# Altium project Digital Clock.PrjPCB
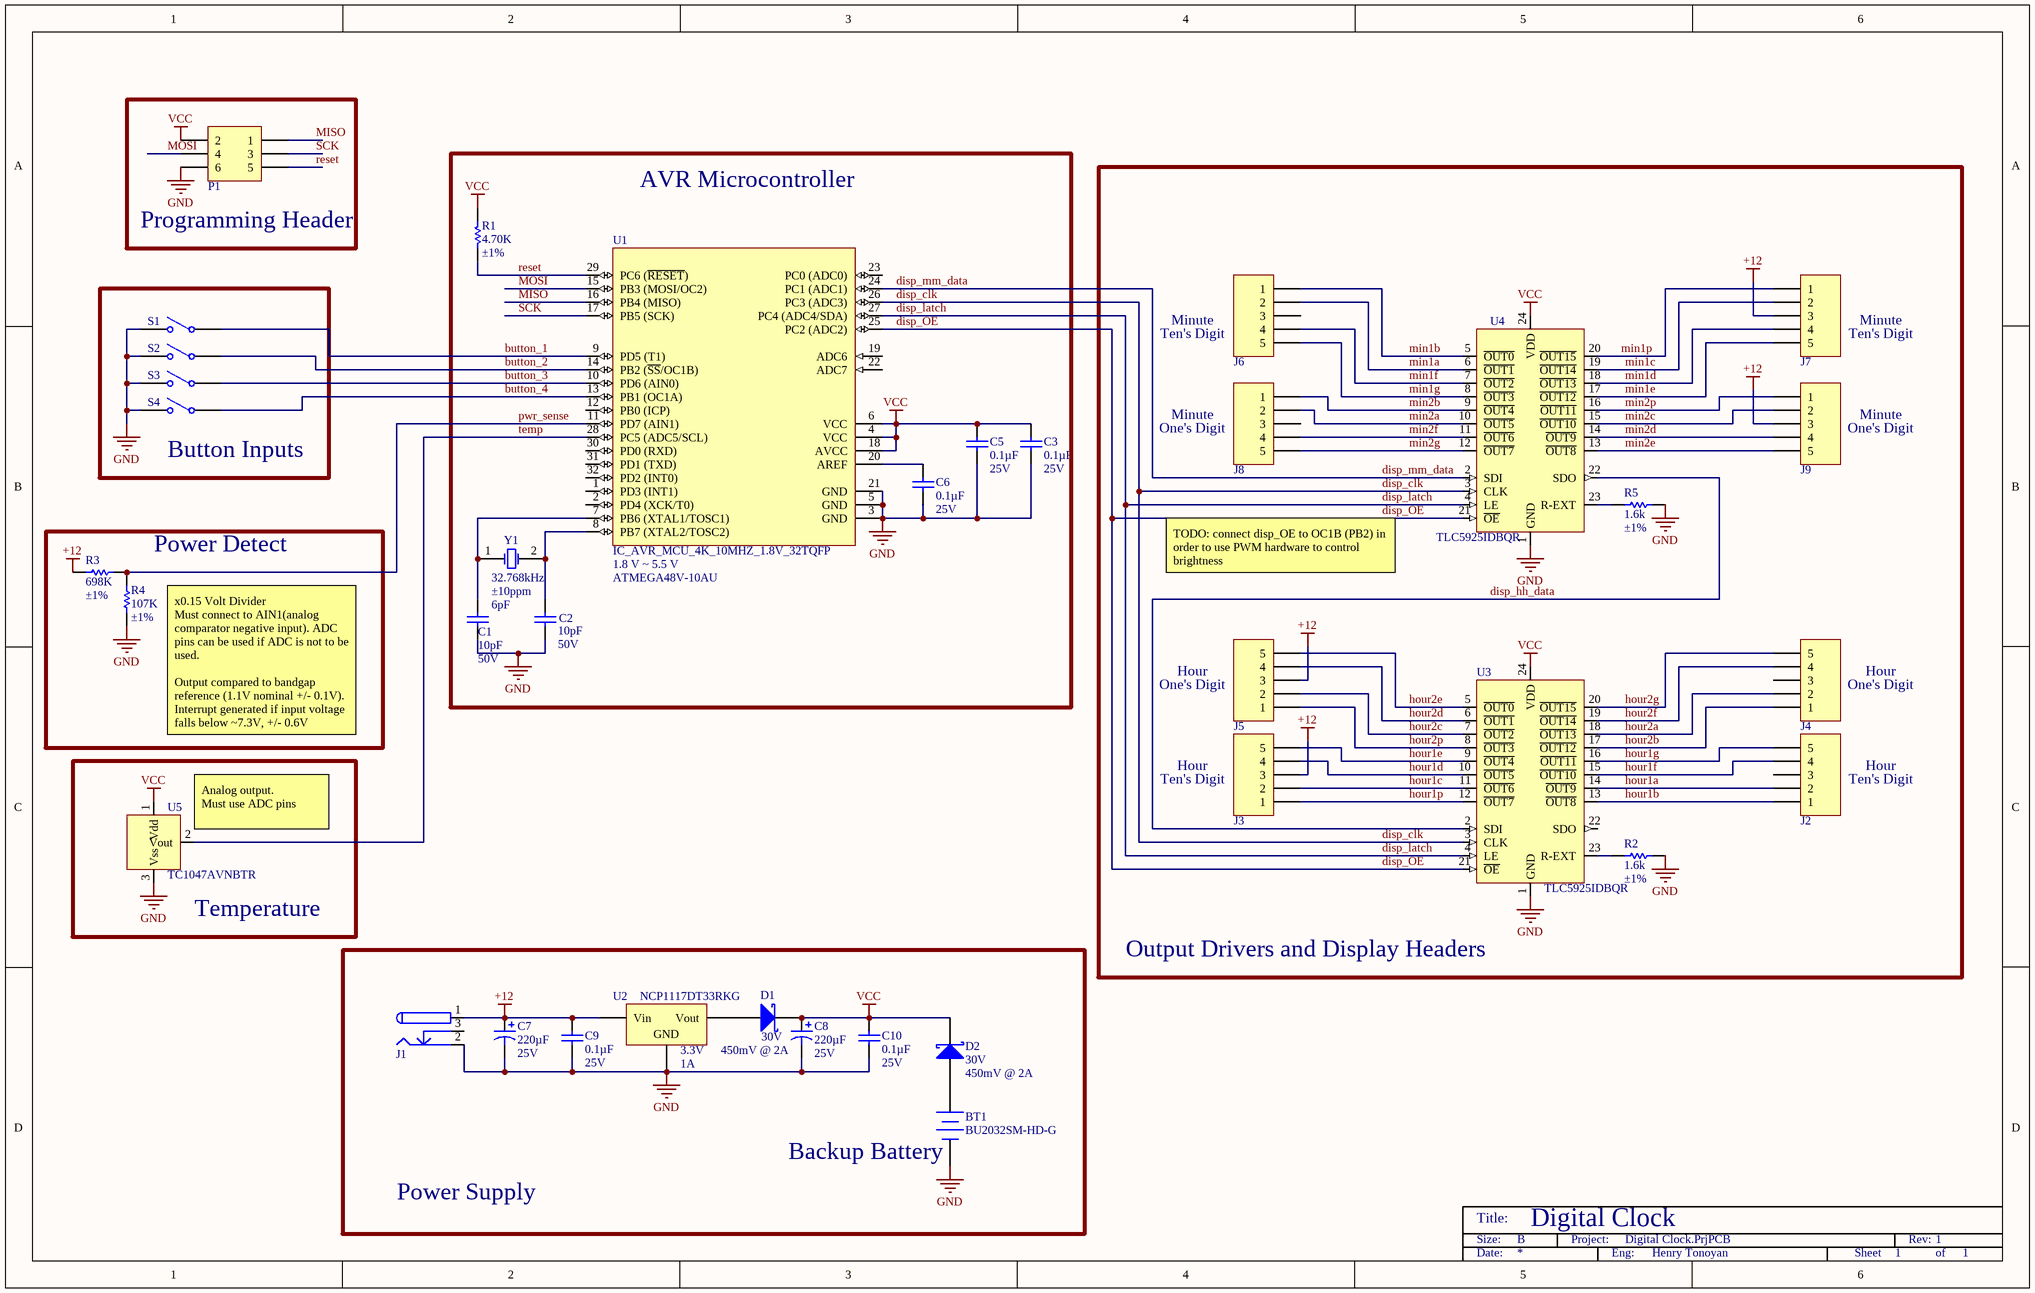
[diagram p0: main.SchDoc]
1 sheet, 37 parts. Net scope: global (net labels, ports and power ports of the same name join across sheets).
Board file: PCB1.PcbDoc

## Sheet main.SchDoc: Digital Clock
size B; Engineer: Henry Tonoyan; Revision: 1; SheetNumber: 1; SheetTotal: 1

### Parts
BT1  HOLDER COIN CELL 2032 SMD  [BU2032SM-HD-G]  (value not drawn)
C1  Capacitance: 10pF  Voltage - Rated: 50V  [0603]  (hidden comment: CAP CER 10PF 50V 5% C0G 0603)
C2  Capacitance: 10pF  Voltage - Rated: 50V  [0603]  (hidden comment: CAP CER 10PF 50V 5% C0G 0603)
C3  Capacitance: 0.1µF  Voltage - Rated: 25V  [0603]  (hidden comment: CAP CER .10UF 25V X7R 10% 0603)
C5  Capacitance: 0.1µF  Voltage - Rated: 25V  [0603]  (hidden comment: CAP CER .10UF 25V X7R 10% 0603)
C6  Capacitance: 0.1µF  Voltage - Rated: 25V  [0603]  (hidden comment: CAP CER .10UF 25V X7R 10% 0603)
C7  Capacitance: 220µF  Voltage Rating: 25V  [CAP AVE227M25F24T-F]  (hidden comment: CAP ALUM 220UF 25V 20% SMD)
C8  Capacitance: 220µF  Voltage Rating: 25V  [CAP AVE227M25F24T-F]  (hidden comment: CAP ALUM 220UF 25V 20% SMD)
C9  Capacitance: 0.1µF  Voltage - Rated: 25V  [0603]  (hidden comment: CAP CER .10UF 25V X7R 10% 0603)
C10  Capacitance: 0.1µF  Voltage - Rated: 25V  [0603]  (hidden comment: CAP CER .10UF 25V X7R 10% 0603)
D1  Voltage - DC Reverse (Vr) (Max): 30V  Voltage - Forward (Vf) (Max) @ If: 450mV @ 2A  [DSO-C2/X2.3]  (hidden comment: DIODE_SCHOTTKY_30V_2A_SMB)
D2  Voltage - DC Reverse (Vr) (Max): 30V  Voltage - Forward (Vf) (Max) @ If: 450mV @ 2A  [DSO-C2/X2.3]  (hidden comment: DIODE_SCHOTTKY_30V_2A_SMB)
J1  CONN_PWR2.0_SMT  [CONN_PWR2.0_SMT]  (value not drawn)
J2  CONN_HEADER_VERT_5POS_.100_TIN  [CONN_HDR1X5]  (value not drawn)
J3  CONN_HEADER_VERT_5POS_.100_TIN  [CONN_HDR1X5]  (value not drawn)
J4  CONN_HEADER_VERT_5POS_.100_TIN  [CONN_HDR1X5]  (value not drawn)
J5  CONN_HEADER_VERT_5POS_.100_TIN  [CONN_HDR1X5]  (value not drawn)
J6  CONN_HEADER_VERT_5POS_.100_TIN  [CONN_HDR1X5]  (value not drawn)
J7  CONN_HEADER_VERT_5POS_.100_TIN  [CONN_HDR1X5]  (value not drawn)
J8  CONN_HEADER_VERT_5POS_.100_TIN  [CONN_HDR1X5]  (value not drawn)
J9  CONN_HEADER_VERT_5POS_.100_TIN  [CONN_HDR1X5]  (value not drawn)
P1  Header, 3-Pin, Dual row  [CONN_HDR_SMT_6_2R]  (value not drawn)
R1  Resistance (Ohms): 4.70K  Tolerance: ±1%  [0603]  (hidden comment: RES_4.70K_OHM_1/10W_1%_0603_SMD)
R2  Resistance (Ohms): 1.6k  Tolerance: ±1%  [0603]  (hidden comment: RES_1.60K_OHM_1/10W_1%_0603_SMD)
R3  Resistance (Ohms): 698K  Tolerance: ±1%  [0603]  (hidden comment: RES_698K_OHM_1/10W_1%_0603_SMD)
R4  Resistance (Ohms): 107K  Tolerance: ±1%  [0603]  (hidden comment: RES_107K_OHM_1/10W_1%_0603_SMD)
R5  Resistance (Ohms): 1.6k  Tolerance: ±1%  [0603]  (hidden comment: RES_1.60K_OHM_1/10W_1%_0603_SMD)
S1  SW_1571634-2  [1571634-2]  (value not drawn)
S2  SW_1571634-2  [1571634-2]  (value not drawn)
S3  SW_1571634-2  [1571634-2]  (value not drawn)
S4  SW_1571634-2  [1571634-2]  (value not drawn)
U1  IC_AVR_MCU_4K_10MHZ_1.8V_32TQFP  Voltage - Supply (Vcc/Vdd): 1.8 V ~ 5.5 V  Manufacturer Part Number: ATMEGA48V-10AU  [32A_N]
U2  Manufacturer Part Number: NCP1117DT33RKG  Voltage - Output: 3.3V  Current - Output: 1A  [DPAK]  (hidden comment: IC_REG_LDO_3.3V_DPAK)
U3  Manufacturer Part Number: TLC5925IDBQR  [SOP24]  (hidden comment: IC_LED_DRIVER_LINEAR_24-QSOP)
U4  Manufacturer Part Number: TLC5925IDBQR  [SOP24]  (hidden comment: IC_LED_DRIVER_LINEAR_24-QSOP)
U5  Manufacturer Part Number: TC1047AVNBTR  [SOT23-3N]  (hidden comment: Temperature Sensor)
Y1  Frequency: 32.768kHz  Frequency Tolerance: ±10ppm  Load Capacitance: 6pF  [ABS25]  (hidden comment: CRYSTAL_32.768_KHZ_6.0 PF_SMD)

### Blocks framed on the sheet
Programming Header: P1
AVR Microcontroller: C1-C3 C5 C6 R1 U1 Y1
Output Drivers and Display Headers: J2-J9 R2 R5 U3 U4
Button Inputs: S1-S4
Power Detect: R3 R4
Temperature: U5

### Nets
+12: C7.1 C9.2 J1.1 J3.3 J5.3 J7.3 J9.3 R3.1 U2.1(Vin)
GND: BT1.2(-) C1.1 C2.1 C3.2 C5.2 C6.2 C7.2 C8.2 C9.1 C10.1 J1.2 P1.6 R2.2 R4.1 R5.2 S1.2(NO) S2.2(NO) S3.2(NO) S4.2(NO) U1.3(GND) U1.5(GND) U1.21(GND) U2.2(GND) U3.1(GND) U4.1(GND) U5.3(Vss)
VCC: C3.1 C5.1 C8.1 C10.2 D1.2(K) D2.2(K) P1.2 R1.2 U1.4(VCC) U1.6(VCC) U1.18(AVCC) U3.24(VDD) U4.24(VDD) U5.1(Vdd)
button_1: S1.1(COMMON) U1.9(PD5_(T1))
button_2: S2.1(COMMON) U1.14(PB2_(~{SS}/OC1B))
button_3: S3.1(COMMON) U1.10(PD6_(AIN0))
button_4: S4.1(COMMON) U1.13(PB1_(OC1A))
disp_clk: U1.26(PC3_(ADC3)) U3.3(CLK) U4.3(CLK)
disp_hh_data: U3.2(SDI) U4.22(SDO)
disp_latch: U1.27(PC4_(ADC4/SDA)) U3.4(LE) U4.4(LE)
disp_mm_data: U1.24(PC1_(ADC1)) U4.2(SDI)
disp_~{OE}: U1.25(PC2_(ADC2)) U3.21(~{OE}) U4.21(~{OE})
hour1a: J2.2 U3.14(~{OUT9})
hour1b: J2.1 U3.13(~{OUT8})
hour1c: J3.2 U3.11(~{OUT6})
hour1d: J3.4 U3.10(~{OUT5})
hour1e: J3.5 U3.9(~{OUT4})
hour1f: J2.4 U3.15(~{OUT10})
hour1g: J2.5 U3.16(~{OUT11})
hour1p: J3.1 U3.12(~{OUT7})
hour2a: J4.2 U3.18(~{OUT13})
hour2b: J4.1 U3.17(~{OUT12})
hour2c: J5.2 U3.7(~{OUT2})
hour2d: J5.4 U3.6(~{OUT1})
hour2e: J5.5 U3.5(~{OUT0})
hour2f: J4.4 U3.19(~{OUT14})
hour2g: J4.5 U3.20(~{OUT15})
hour2p: J5.1 U3.8(~{OUT3})
min1a: J6.2 U4.6(~{OUT1})
min1b: J6.1 U4.5(~{OUT0})
min1c: J7.2 U4.19(~{OUT14})
min1d: J7.4 U4.18(~{OUT13})
min1e: J7.5 U4.17(~{OUT12})
min1f: J6.4 U4.7(~{OUT2})
min1g: J6.5 U4.8(~{OUT3})
min1p: J7.1 U4.20(~{OUT15})
min2a: J8.2 U4.10(~{OUT5})
min2b: J8.1 U4.9(~{OUT4})
min2c: J9.2 U4.15(~{OUT10})
min2d: J9.4 U4.14(~{OUT9})
min2e: J9.5 U4.13(~{OUT8})
min2f: J8.4 U4.11(~{OUT6})
min2g: J8.5 U4.12(~{OUT7})
min2p: J9.1 U4.16(~{OUT11})
MISO: P1.1 U1.16(PB4_(MISO))
MOSI: P1.4 U1.15(PB3_(MOSI/OC2))
pwr_sense: R3.2 R4.2 U1.11(PD7_(AIN1))
reset: P1.5 R1.1 U1.29(PC6_(~{RESET}))
SCK: P1.3 U1.17(PB5_(SCK))
temp: U1.28(PC5_(ADC5/SCL)) U5.2(Vout)
NetBT1_1: BT1.1(+) D2.1(A)
NetC1_2: C1.2 U1.7(PB6_(XTAL1/TOSC1)) Y1.1(OSC1)
NetC2_2: C2.2 U1.8(PB7_(XTAL2/TOSC2)) Y1.2(OSC2)
NetC6_1: C6.1 U1.20(AREF)
NetD1_1: D1.1(A) U2.3(Vout)
NetR2_1: R2.1 U3.23(R-EXT)
NetR5_1: R5.1 U4.23(R-EXT)

Not connected (* = marked no-connect by the designer): J1 3; J2 3; J4 3; J6 3; J8 3; U1 1(PD3_(INT1)) 2(PD4_(XCK/T0)) 12(PB0_(ICP)) 19(ADC6) 22(ADC7) 23(PC0_(ADC0)) 30(PD0_(RXD)) 31(PD1_(TXD)) 32(PD2_(INT0)); U3 22(SDO)

### Notes on the sheet
- Minute
- (near J6) Ten's Digit
- (near J7) Ten's Digit
- (near J8) One's Digit
- (near J9) One's Digit
- TODO: connect disp_OE to OC1B (PB2) in order to use PWM hardware to control brightness
- Hour
- (near J5) One's Digit
- (near J4) One's Digit
- x0.15 Volt Divider
  Must connect to AIN1(analog comparator negative input). ADC pins can be used if ADC is not to be used.
  Output compared to bandgap reference (1.1V nominal +/- 0.1V). Interrupt generated if input voltage falls below ~7.3V, +/- 0.6V
- (near U5) Analog output.
  Must use ADC pins
- (near J3) Ten's Digit
- (near J2) Ten's Digit
- (near BT1) Backup Battery
- Power Supply
- Title:
- Size:
- B
- Project:
- Rev:
- Date:
- Eng:
- Sheet
- of

### Library data of the parts
BT1 = BU2032SM-HD-G: Manufacturer: MPD (Memory Protection Devices); Battery Type, Function: Coin Cell, Holder; Style: Holder (Open); Battery Cell Size: Coin, 20.0mm; Number of Cells: 1; Battery Series: 2032; Supplier 1: Digi-Key; RoHS: RoHS Compliant; Category: Battery Products; Stock 1: 33207; Pricing 1: 1=0.82, 10=0.755 (USD); Mounting Type: PCB, Surface Mount; Termination Style: SMD (SMT) Tab; Height Above Board: 0.208" (5.28mm); Operating Temperature: -40°C ~ 280°C; ComponentLink1URL: http://www.memoryprotectiondevices.com/datasheets/BU2032SM-HD-G-datasheet.pdf; ComponentLink1Description: Datasheet; Supplier Part Number 1: BU2032SM-HD-GDKR-ND; Manufacturer Part Number: BU2032SM-HD-G
C1 C2 = CAP_CER_10PF_50V_5%_C0G_0603: Manufacturer: Murata Electronics North America; Manufacturer Part Number: GRM1885C1H100JA01D; Temperature Coefficient: C0G, NP0; Supplier 1: Digi-Key; RoHS: RoHS Compliant; Category: Capacitors; Stock 1: 81574; Pricing 1: 1=0.1, 10=0.041, 50=0.0222, 100=0.0187, 250=0.01532, 500=0.0131, 1000=0.0102 (USD); Tolerance: ±5%; Mounting Type: Surface Mount, MLCC; Operating Temperature: -55°C ~ 125°C; Applications: General Purpose; Ratings: -; Package / Case: 0603 (1608 Metric); Size / Dimension: 0.063" L x 0.031" W (1.60mm x 0.80mm); Height - Seated (Max): -; Thickness (Max): 0.035" (0.90mm); Lead Spacing: -; Features: -; Packaging: Cut Tape (CT); Lead Style: -; ComponentLink1URL: http://search.murata.co.jp/Ceramy/image/img/PDF/ENG/GRM1885C1H100JA01.pdf; ComponentLink1Description: Datasheet; Supplier Part Number 1: 490-1403-1-ND
C3 C5 C6 C9 C10 = CAP_CER_.10UF_25V_X7R_10%_0603_1: Manufacturer: TDK Corporation; Manufacturer Part Number: C1608X7R1E104K; Supplier 1: Digi-Key; RoHS: RoHS Compliant; Category: Capacitors; Stock 1: 1271235; Pricing 1: 1=0.1, 10=0.024, 100=0.011, 250=0.009, 500=0.0077, 1000=0.006 (USD); Tolerance: ±10%; Temperature Coefficient: X7R; Mounting Type: Surface Mount, MLCC; Operating Temperature: -55°C ~ 125°C; Applications: General Purpose; Ratings: -; Package / Case: 0603 (1608 Metric); Size / Dimension: 0.063" L x 0.031" W (1.60mm x 0.80mm); Height - Seated (Max): -; Thickness (Max): 0.037" (0.95mm); Lead Spacing: -; Features: -; Packaging: Cut Tape (CT); Lead Style: -; ComponentLink1URL: http://www.tdk.com/pdf/general_B11.pdf; ComponentLink1Description: Datasheet; Supplier Part Number 1: 445-1316-1-ND
C7 C8 = CAP_ALUM_220UF_25V_20%_SMD: Manufacturer: Cornell Dubilier Electronics (CDE); Manufacturer Part Number: AVE227M25F24T-F; Lifetime @ Temp.: 2000 Hrs @ 85°C; Ripple Current: 252mA; ESR (Equivalent Series Resistance): 1.06 Ohm; Surface Mount Land Size: 0.331" L x 0.331" W (8.40mm x 8.40mm); Supplier 1: Digi-Key; RoHS: RoHS Compliant; Category: Capacitors; Stock 1: 1214; Pricing 1: 1=0.69, 10=0.663, 100=0.3218, 250=0.26732 (USD); Tolerance: ±20%; Operating Temperature: -40°C ~ 85°C; Features: General Purpose; Impedance: -; Mounting Type: Surface Mount; Package / Case: Radial, Can - SMD; Size / Dimension: 0.315" Dia (8.00mm); Height - Seated (Max): 0.394" (10.00mm); Lead Spacing: -; Packaging: Cut Tape (CT); ComponentLink1URL: http://www.cde.com/catalogs/AVE.pdf; ComponentLink1Description: Datasheet; Supplier Part Number 1: 338-1807-1-ND
D1 D2 = DIODE_SCHOTTKY_30V_2A_SMB: DIODE SCHOTTKY 30V 2A SMB; Manufacturer: STMicroelectronics; Manufacturer Part Number: STPS2L30UF; Speed: Fast Recovery =< 500ns, > 200mA (Io); Current - Reverse Leakage @ Vr: 200µA @ 30V; Supplier 1: Digi-Key; RoHS: RoHS Compliant; Category: Discrete Semiconductor Products; Stock 1: 6877; Pricing 1: 1=0.91, 10=0.798, 25=0.7048, 100=0.6144, 250=0.53484, 500=0.45526, 1000=0.36465, 2500=0.32929 (USD); Diode Type: Schottky; Reverse Recovery Time (trr): -; Capacitance @ Vr, F: -; Mounting Type: Surface Mount; Package / Case: DO-214AA, SMB; Supplier Device Package: SMBflat; Packaging: Digi-Reel®; ComponentLink1URL: http://www.st.com/internet/com/TECHNICAL_RESOURCES/TECHNICAL_LITERATURE/DATASHEET/CD00001633.pdf; ComponentLink1Description: Datasheet; Supplier Part Number 1: 497-8030-6-ND; Current - Average Rectified (Io): 2A
J1 = CONN_PWR2.0_SMT: CONN PWR JACK 2.0X6.3MM SMT; Manufacturer: CUI Inc; Manufacturer Part Number: PJ-036A-SMT; Gender: Male; Plug/Mating Plug Diameter: 2.1mm ID, 5.5mm OD; Number of Positions/Contacts: 2 Conductors, 3 Contacts; Internal Switch(s): Single Switch, Normally Closed; Shielding: Unshielded; Voltage - Rated: 16VDC; Current Rating: 2.5A; Supplier 1: Digi-Key; RoHS: RoHS Compliant; Category: Connectors, Interconnects; Stock 1: 20300; Pricing 1: 1=1.67, 10=1.297, 100=0.9895 (USD); Connector Type: Jack; Mounting Type: Surface Mount, Right Angle; Termination: Solder; Features: -; Color: Black; Contact Material: Brass; Contact Material - Plating: Silver; Housing Color: Black; Housing Material: Thermoplastic; Operating Temperature: -25°C ~ 85°C; ComponentLink1URL: http://www.cui.com/Product/Resource/DigiKeyPDF/PJ-036A-SMT.pdf; ComponentLink1Description: Datasheet; Supplier Part Number 1: CP-036APJCT-ND
J2-J9 = CONN_HEADER_VERT_5POS_.100_TIN: CONN HEADER VERT 5POS .100 TIN; Manufacturer: TE Connectivity; Manufacturer Part Number: 640454-5; Connector Type: Header, Unshrouded; Number of Positions: 5; Number of Positions Loaded: All; Pitch: 0.100" (2.54mm); Supplier 1: Digi-Key; RoHS: RoHS Compliant; Category: Connectors, Interconnects; Stock 1: 9451; Pricing 1: 1=0.19, 10=0.179, 50=0.1332, 100=0.1238, 250=0.10948, 500=0.10472, 1000=0.08568, 2500=0.07854, 5000=0.0714 (USD); Contact Type: Male Pin; Number of Rows: 1; Row Spacing: -; Contact Mating Length: 0.295" (7.49mm); Mounting Type: Through Hole; Termination: Solder; Fastening Type: -; Features: Polarizing Key; Contact Finish: Tin; Contact Finish Thickness: -; Color: Natural; Packaging: Bulk; ComponentLink1URL: http://www.te.com/commerce/DocumentDelivery/DDEController?Action=srchrtrv&DocNm=640454&DocType=Customer+Drawing&DocLang=English; ComponentLink1Description: http://www.te.com/commerce/DocumentDelivery/DDEController?Action=srchrtrv&DocNm=640454&DocType=Customer+Drawing&DocLang=English; Supplier Part Number 1: A19432-ND
P1 = CONN_Header_0.100_6pos: Manufacturer: Molex Connector Corporation; Connector Type: Header, Unshrouded, Breakaway; Number of Positions: 6; Number of Positions Loaded: All; Pitch: 0.100" (2.54mm); Supplier 1: Digi-Key; Manufacturer Part Number: 15-91-2060; RoHS: RoHS Compliant; Category: Connectors, Interconnects; Stock 1: 2541; Pricing 1: 1=0.82, 10=0.576, 50=0.4442, 100=0.3866, 250=0.329, 500=0.31256, 1000=0.27965, 2500=0.22208, 5000=0.21879 (USD); Contact Type: Male Pin; Number of Rows: 2; Row Spacing: 0.100" (2.54mm); Contact Mating Length: 0.240" (6.10mm); Mounting Type: Surface Mount; Termination: Solder; Fastening Type: -; Features: -; Contact Finish: Tin; Contact Finish Thickness: 150µin (3.81µm); Color: Black; Packaging: Bulk; ComponentLink1URL: http://www.molex.com/pdm_docs/sd/015912060_sd.pdf; ComponentLink1Description: Datasheet; Supplier Part Number 1: WM17449-ND
R1 = RES_4.70K_OHM_1/10W_1%_0603_SMD: RES 4.70K OHM 1/10W 1% 0603 SMD; Manufacturer: Panasonic Electronic Components; Manufacturer Part Number: ERJ-3EKF4701V; Power (Watts): 0.1W, 1/10W; Temperature Coefficient: ±100ppm/°C; Supplier 1: Digi-Key; RoHS: RoHS Compliant; Category: Resistors; Stock 1: 955812; Pricing 1: 1=0.1, 50=0.0138, 100=0.0105, 250=0.0078, 500=0.00576, 1000=0.00384 (USD); Composition: Thick Film; Features: -; Package / Case: 0603 (1608 Metric); Size / Dimension: 0.063" L x 0.031" W (1.60mm x 0.80mm); Height: 0.022" (0.55mm); Number of Terminations: 2; Packaging: Cut Tape (CT); ComponentLink1URL: http://industrial.panasonic.com/www-cgi/jvcr13pz.cgi?E+PZ+3+AOA0002+ERJ3EKF4701V+7+WW; ComponentLink1Description: Datasheet; Supplier Part Number 1: P4.70KHCT-ND
R2 R5 = RES_1.60K_OHM_1/10W_1%_0603_SMD: RES 1.60K OHM 1/10W 1% 0603 SMD; Manufacturer: Panasonic Electronic Components; Manufacturer Part Number: ERJ-3EKF1601V; Power (Watts): 0.1W, 1/10W; Temperature Coefficient: ±100ppm/°C; Supplier 1: Digi-Key; RoHS: RoHS Compliant; Category: Resistors; Stock 1: 71684; Pricing 1: 1=0.1, 50=0.0138, 100=0.0105, 250=0.0078, 500=0.00576, 1000=0.00384 (USD); Composition: Thick Film; Features: -; Package / Case: 0603 (1608 Metric); Size / Dimension: 0.063" L x 0.031" W (1.60mm x 0.80mm); Height: 0.022" (0.55mm); Number of Terminations: 2; Packaging: Digi-Reel®; ComponentLink1URL: http://industrial.panasonic.com/www-cgi/jvcr13pz.cgi?E+PZ+3+AOA0002+ERJ3EKF1601V+7+WW; ComponentLink1Description: Datasheet; Supplier Part Number 1: P1.60KHDKR-ND
R3 = RES_698K_OHM_1/10W_1%_0603_SMD: RES 698K OHM 1/10W 1% 0603 SMD; Manufacturer: Panasonic Electronic Components; Manufacturer Part Number: ERJ-3EKF6983V; Power (Watts): 0.1W, 1/10W; Temperature Coefficient: ±100ppm/°C; Supplier 1: Digi-Key; RoHS: RoHS Compliant; Category: Resistors; Stock 1: 28989; Pricing 1: 1=0.1, 50=0.0138, 100=0.0105, 250=0.0078, 500=0.00576, 1000=0.00384 (USD); Composition: Thick Film; Features: -; Package / Case: 0603 (1608 Metric); Size / Dimension: 0.063" L x 0.031" W (1.60mm x 0.80mm); Height: 0.022" (0.55mm); Number of Terminations: 2; Packaging: Digi-Reel®; ComponentLink1URL: http://industrial.panasonic.com/www-cgi/jvcr13pz.cgi?E+PZ+3+AOA0002+ERJ3EKF6983V+7+WW; ComponentLink1Description: Datasheet; Supplier Part Number 1: P698KHDKR-ND
R4 = RES_107K_OHM_1/10W_1%_0603_SMD: RES 107K OHM 1/10W 1% 0603 SMD; Manufacturer: Panasonic Electronic Components; Manufacturer Part Number: ERJ-3EKF1073V; Power (Watts): 0.1W, 1/10W; Temperature Coefficient: ±100ppm/°C; ComponentLink1URL: http://industrial.panasonic.com/www-cgi/jvcr13pz.cgi?E+PZ+3+AOA0002+ERJ3EKF6983V+7+WW; ComponentLink1Description: Datasheet; Supplier 1: Digi-Key; RoHS: RoHS Compliant; Category: Resistors; Stock 1: 116149; Pricing 1: 1=0.1, 50=0.0138, 100=0.0105, 250=0.0078, 500=0.00576, 1000=0.00384 (USD); Composition: Thick Film; Features: -; Package / Case: 0603 (1608 Metric); Size / Dimension: 0.063" L x 0.031" W (1.60mm x 0.80mm); Height: 0.022" (0.55mm); Number of Terminations: 2; Packaging: Cut Tape (CT); Supplier Part Number 1: P107KHCT-ND
S1-S4 = SW_1571634-2: Single-Pole, Single-Throw Switch; Manufacturer: TE Connectivity / Alcoswitch; Contact Form: SPST-NO; Current Rating: 50 mA; Illumination: Not Illuminated; Switch Function: Momentary; Voltage Rating DC: 24 V; Published: 24-Mar-1999; LatestRevisionDate: 17-Jul-2002; LatestRevisionNote: Re-released for DXP Platform.; PackageReference: SPST-2; Publisher: Altium Limited; PackageDescription: Switch; 2 Leads; Supplier 1: Mouser; Manufacturer Part Number: 1571634-2; RoHS: RoHS Compliant; Category: Pushbutton Switches; Stock 1: 711; Pricing 1: 1=0.392, 25=0.347, 50=0.316, 100=0.302, 200=0.271, 500=0.240, 1000=0.227 (AUD); Packaging: Reel; Termination Style: Gull Wing; Mounting Style: SMD/SMT; Product Category: Pushbutton Switches; Standard Pack Qty: 1000; RoHS - Mouser: Y; Minimum Order Quantity: 1; Reeling: True; ComponentLink1URL: http://www.mouser.com/ds/2/418/NG_CD_1571634_F1-116640.pdf; ComponentLink1Description: Datasheet; Supplier Part Number 1: 506-1571634-2
U1 = IC_AVR_MCU_4K_10MHZ_1.8V_32TQFP: IC AVR MCU 4K 10MHZ 1.8V 32TQFP; Manufacturer: Atmel; Core Size: 8-Bit; Connectivity: I²C, SPI, UART/USART; Peripherals: Brown-out Detect/Reset, POR, PWM, WDT; Number of I /O: 23; Program Memory Size: 4KB (2K x 16); Program Memory Type: FLASH; EEPROM Size: 256 x 8; RAM Size: 512 x 8; Data Converters: A/D 8x10b; Oscillator Type: Internal; Supplier 1: Digi-Key; RoHS: RoHS Compliant; Category: Integrated Circuits (ICs); Stock 1: 15971; Pricing 1: 1=2.73, 25=1.7144, 100=1.524 (USD); Core Processor: AVR; Speed: 10MHz; Operating Temperature: -40°C ~ 85°C; Package / Case: 32-TQFP; Packaging: Tray; ComponentLink1URL: http://www.atmel.com/Images/2545s.pdf; Supplier Part Number 1: ATMEGA48V-10AU-ND; ComponentLink1Description: Datasheet
U2 = IC_REG_LDO_3.3V_DPAK: IC REG LDO 3.3V DPAK; pin to pad: 1>3 2>1 3>2; Manufacturer: ON Semiconductor; Regulator Topology: Positive Fixed; Voltage - Input: Up to 20V; Voltage - Dropout (Typical): 1.07V @ 800mA; Number of Regulators: 1; Supplier 1: Digi-Key; RoHS: RoHS Compliant; Category: Integrated Circuits (ICs); Stock 1: 9630; Pricing 1: 1=0.49, 10=0.417, 25=0.3652, 100=0.3127, 250=0.2712, 500=0.22972, 1000=0.1771 (USD); Current - Limit (Min): 1A; Operating Temperature: 0°C ~ 125°C; Mounting Type: Surface Mount; Package / Case: TO-252-3, DPak (2 Leads + Tab), SC-63; Supplier Device Package: DPAK-3; Packaging: Cut Tape (CT); ComponentLink1URL: http://www.onsemi.com/pub_link/Collateral/NCP1117-D.PDF; ComponentLink1Description: Datasheet; Supplier Part Number 1: NCP1117DT33RKGOSCT-ND
U3 U4 = IC_LED_DRIVER_LINEAR_24-QSOP: IC LED DRIVER LINEAR 24-QSOP; Manufacturer: Texas Instruments; Constant Current: Yes; Topology: Linear, High Side; Number of Outputs: 16; Type - Primary: LED Lighting Display, Signage, Automotive; Frequency: 30MHz; Voltage - Supply: 3 V ~ 5.5 V; Voltage - Output: 17V; Supplier 1: Digi-Key; RoHS: RoHS Compliant; Category: Integrated Circuits (ICs); Stock 1: 6953; Pricing 1: 1=1.6, 10=1.44, 25=1.29, 100=1.16, 250=1.03, 500=0.9, 1000=0.745 (USD); Constant Voltage: -; Internal Driver: Yes; Type - Secondary: -; Mounting Type: Surface Mount; Package / Case: 24-SSOP (0.154", 3.90mm Width); Supplier Device Package: 24-SSOP/QSOP; Packaging: Cut Tape (CT); Operating Temperature: -40°C ~ 85°C; ComponentLink1URL: http://www.ti.com/lit/ds/symlink/tlc5925.pdf; ComponentLink1Description: Datasheet; Supplier Part Number 1: 296-23916-1-ND
U5 = IC_TEMP-VOLT_CONV_PREC_SOT-23B: IC TEMP-VOLT CONV PREC SOT-23B; Manufacturer: Microchip Technology; Sensing Temperature: -40°C ~ 125°C; Output Type: Voltage; Voltage - Supply: 2.5 V ~ 5.5 V; Accuracy: ±0.5°C; Supplier 1: Digi-Key; RoHS: RoHS Compliant; Category: Sensors, Transducers; Stock 1: 17104; Pricing 1: 1=0.74, 10=0.62, 25=0.52, 100=0.47 (USD); Package / Case: TO-236-3, SC-59, SOT-23-3; Supplier Device Package: SOT-23-3; Packaging: Cut Tape (CT); ComponentLink1Description: Datasheet; ComponentLink1URL: http://ww1.microchip.com/downloads/en/DeviceDoc/21498c.pdf; Supplier Part Number 1: TC1047AVNBCT-ND
Y1 = CRYSTAL_32.768_KHZ_6.0 PF_SMD: CRYSTAL 32.768 KHZ 6.0 PF SMD; pin to pad: 2>4; Manufacturer: Abracon Corporation; Manufacturer Part Number: ABS25-32.768KHZ-6-1-T; ESR (Equivalent Series Resistance): 50 kOhm; Operating Mode: Fundamental; Supplier 1: Digi-Key; RoHS: RoHS Compliant; Category: Crystals and Oscillators; Stock 1: 11234; Pricing 1: 1=1.01, 10=0.878, 50=0.7696, 100=0.6075, 500=0.513 (USD); Type: kHz Crystal (Tuning Fork); Frequency Stability: -; Operating Temperature: -40°C ~ 85°C; Ratings: -; Mounting Type: Surface Mount; Package / Case: 4-SOJ, 5.50mm pitch; Size / Dimension: 0.315" L x 0.150" W (8.00mm x 3.80mm); Height: 0.098" (2.50mm); Packaging: Cut Tape (CT); ComponentLink1URL: http://www.abracon.com/Resonators/abs25.pdf; ComponentLink1Description: Datasheet; Supplier Part Number 1: 535-10241-1-ND